# EAGLE schematic DSP_Lab_SS21_Keyboard (EAGLE 9.6.2)
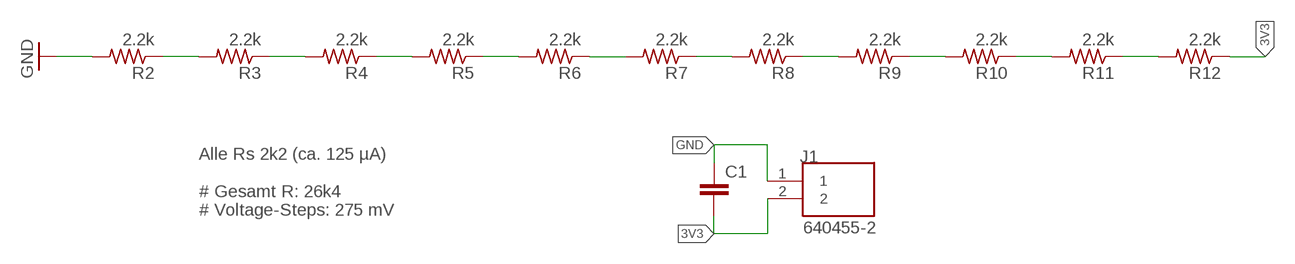
[diagram p0: schematic, sheet 1]

## Parts
C1  C-EUC0603  [C0603]
J1  640455-2  [TE_640455-2]
R2  2.2k  R-US_R0603  [R0603]
R3  2.2k  R-US_R0603  [R0603]
R4  2.2k  R-US_R0603  [R0603]
R5  2.2k  R-US_R0603  [R0603]
R6  2.2k  R-US_R0603  [R0603]
R7  2.2k  R-US_R0603  [R0603]
R8  2.2k  R-US_R0603  [R0603]
R9  2.2k  R-US_R0603  [R0603]
R10  2.2k  R-US_R0603  [R0603]
R11  2.2k  R-US_R0603  [R0603]
R12  2.2k  R-US_R0603  [R0603]

## Nets
3V3: C1.2 J1.2 R12.1
GND: C1.1 J1.1 R2.2
STEP2: R2.1 R3.2
STEP3: R3.1 R4.2
STEP4: R4.1 R5.2
STEP5: R5.1 R6.2
STEP6: R6.1 R7.2
STEP7: R7.1 R8.2
STEP8: R8.1 R9.2
STEP9: R9.1 R10.2
STEP10: R10.1 R11.2
STEP11: R11.1 R12.2

## Notes on the sheet
- Alle Rs 2k2 (ca. 125 µA)
  
  # Gesamt R: 26k4
  # Voltage-Steps: 275 mV

## Library data of the parts
C1 = rcl:C-EU: CAPACITOR, European symbol; SPICEPREFIX: C
J1 = 640455-2:640455-2; AVAILABILITY: Unavailable; COMMENT: 640455-2; DESCRIPTION: MTA-100 2 Position 2.54 mm Single Row Right Angle Wire to Board Header; EU_ROHS_COMPLIANCE: Compliant; MF: TE Connectivity; MP: 640455-2; PACKAGE: None; PRICE: None; TE_PURCHASE_URL: https://www.te.com/usa-en/product-640455-2.html?te_bu=Cor&te_type=disp&te_campaign=seda_glo_cor-seda-global-disp-prtnr-fy19-seda-model-bom-cta_sma-317_1&elqCampaignId=32493
R2-R12 = rcl:R-US_: RESISTOR, American symbol